# Altium schematic sheet buffer.SchDoc
size A4; SheetNumber: 8; SheetTotal: 12
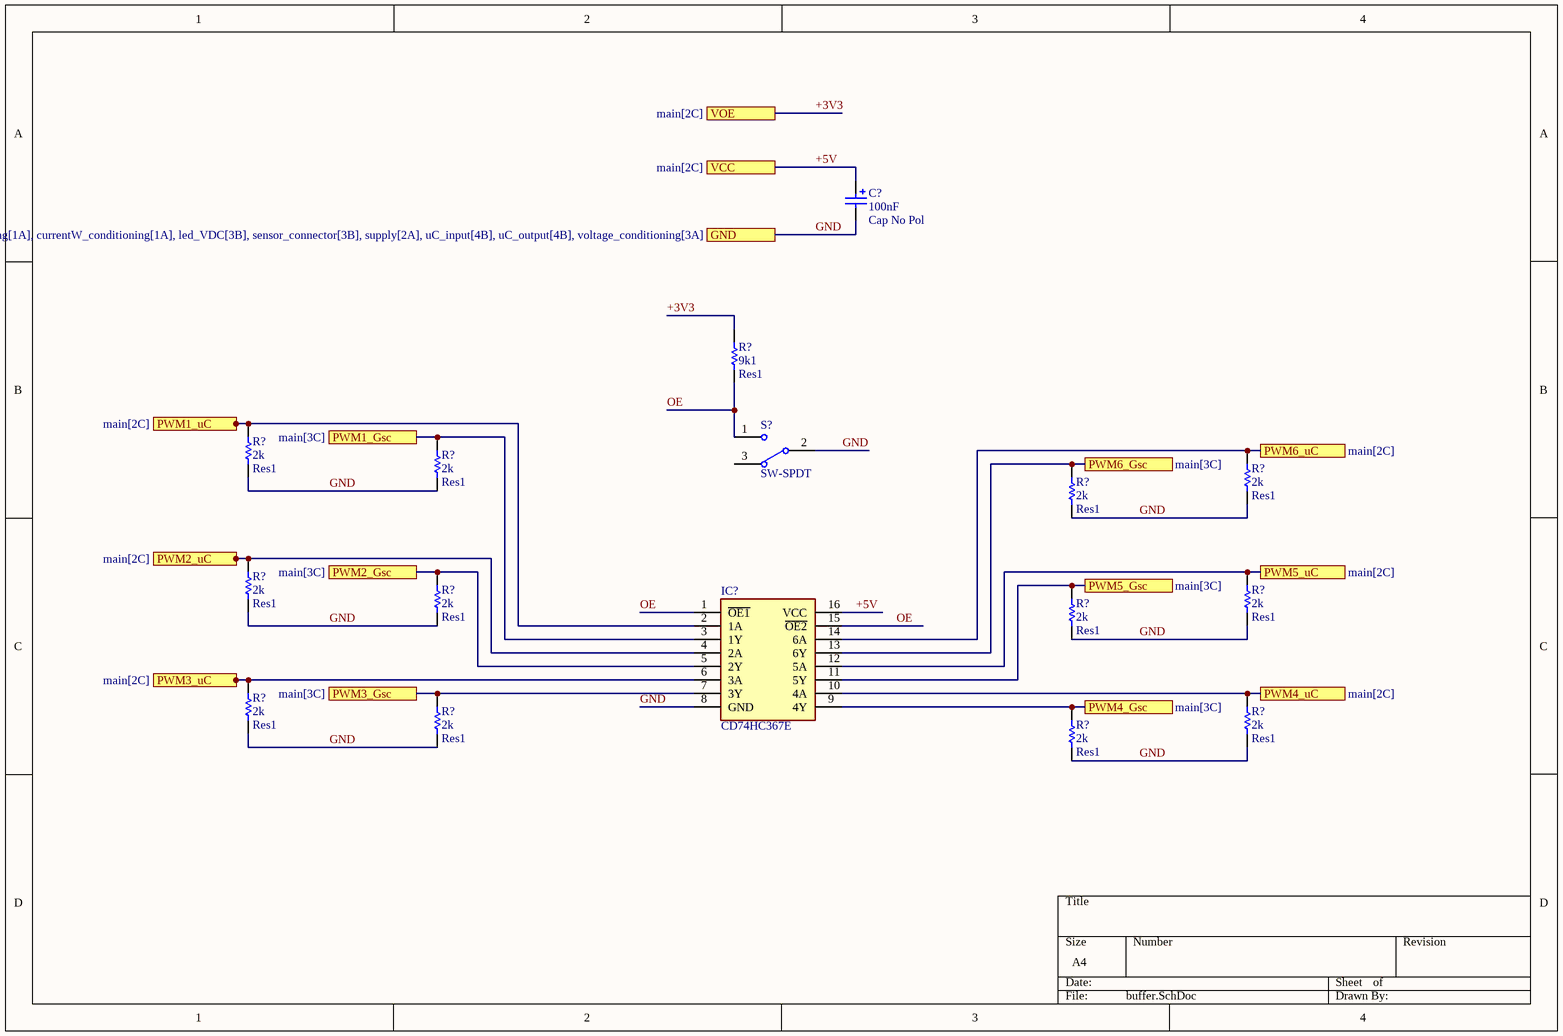
[diagram p0: buffer.SchDoc]

## Parts
(Parts that share a designator on the sheet are numbered #1, #2 ... from top to bottom, then left to right.)
C?  Cap No Pol  value 100nF  [RAD-0.1]
IC?  CD74HC367E  [DIP794W53P254L1930H508Q16N]
R?#1  Res1  value 9k1  [AXIAL-0.3]
R?#2  Res1  value 2k  [AXIAL-0.3]
R?#3  Res1  value 2k  [AXIAL-0.3]
R?#4  Res1  value 2k  [AXIAL-0.3]
R?#5  Res1  value 2k  [AXIAL-0.3]
R?#6  Res1  value 2k  [AXIAL-0.3]
R?#7  Res1  value 2k  [AXIAL-0.3]
R?#8  Res1  value 2k  [AXIAL-0.3]
R?#9  Res1  value 2k  [AXIAL-0.3]
R?#10  Res1  value 2k  [AXIAL-0.3]
R?#11  Res1  value 2k  [AXIAL-0.3]
R?#12  Res1  value 2k  [AXIAL-0.3]
R?#13  Res1  value 2k  [AXIAL-0.3]
S?  SW-SPDT  [MHDR1X3]

## Ports
GND (see main[3C], control_connector[2D], currentU_conditioning[1A], currentV_conditioning[1A], currentW_conditioning[1A], led_VDC[3B], sensor_connector[3B], supply[2A], uC_input[4B], uC_output[4B], voltage_conditioning[3A]), PWM1_Gsc (see main[3C]), PWM1_uC (see main[2C]), PWM2_Gsc (see main[3C]), PWM2_uC (see main[2C]), PWM3_Gsc (see main[3C]), PWM3_uC (see main[2C]), PWM4_Gsc (see main[3C]), PWM4_uC (see main[2C]), PWM5_Gsc (see main[3C]), PWM5_uC (see main[2C]), PWM6_Gsc (see main[3C]), PWM6_uC (see main[2C]), VCC (see main[2C]), VOE (see main[2C])

## Nets
+3V3: R?#1.2 ; port VOE
+5V: C?.1 IC?.16(VCC) ; port VCC
GND: C?.2 IC?.8(GND) R?#2.1 R?#3.1 R?#4.1 R?#5.1 R?#6.1 R?#7.1 R?#8.1 R?#9.1 R?#10.1 R?#11.1 R?#12.1 R?#13.1 S?.2 ; port GND
OE: IC?.1(~{OE1}) IC?.15(~{OE2}) R?#1.1 S?.1
PWM1_Gsc: IC?.3(1Y) R?#3.2 ; port PWM1_Gsc
PWM1_uC: IC?.2(1A) R?#2.2 ; port PWM1_uC
PWM2_Gsc: IC?.5(2Y) R?#7.2 ; port PWM2_Gsc
PWM2_uC: IC?.4(2A) R?#6.2 ; port PWM2_uC
PWM3_Gsc: IC?.7(3Y) R?#11.2 ; port PWM3_Gsc
PWM3_uC: IC?.6(3A) R?#10.2 ; port PWM3_uC
PWM4_Gsc: IC?.9(4Y) R?#13.2 ; port PWM4_Gsc
PWM4_uC: IC?.10(4A) R?#12.2 ; port PWM4_uC
PWM5_Gsc: IC?.11(5Y) R?#9.2 ; port PWM5_Gsc
PWM5_uC: IC?.12(5A) R?#8.2 ; port PWM5_uC
PWM6_Gsc: IC?.13(6Y) R?#5.2 ; port PWM6_Gsc
PWM6_uC: IC?.14(6A) R?#4.2 ; port PWM6_uC

Not connected (* = marked no-connect by the designer): S? 3

## Library data of the parts
C? = Cap No Pol: Polarized Capacitor (Radial); Published: 8-Jun-2000; LatestRevisionDate: 17-Jul-2002; LatestRevisionNote: Re-released for DXP Platform.; PackageReference: RB7.6-15; Publisher: Altium Limited; PackageDescription: Polarized Capacitor (Radial); 2 Leads
IC? = CD74HC367E: Integrated Circuit; Manufacturer_Name: Texas Instruments; Datasheet Link: https://www.ti.com/lit/ds/symlink/cd74hc367.pdf?ts=1619589374451&ref_url=https%253A%252F%252Fwww.ti.com%252Fstore%252Fti%252Fen%252Fp%252Fproduct%252F%253Fp%253DCD74HC367E; Height: 5.08mm; Manufacturer_Part_Number: CD74HC367E; Mouser Part Number: 595-CD74HC367E; Mouser Price/Stock: https://www.mouser.co.uk/ProductDetail/Texas-Instruments/CD74HC367E?qs=xFfolx0DHx1dmtXXzN7naA%3D%3D
R?#1-R?#13 = Res1: Resistor; Published: 8-Jun-2000; LatestRevisionDate: 17-Jul-2002; LatestRevisionNote: Re-released for DXP Platform.; PackageReference: AXIAL-0.3; Publisher: Altium Limited; PackageDescription: Axial Device, Thru-Hole; 2 Leads; 0.3 in Pin Spacing
S? = SW-SPDT: SPDT Subminiature Toggle Switch, Right Angle Mounting, Vertical Actuation; Published: 24-Mar-1999; LatestRevisionDate: 17-Dec-2003; LatestRevisionNote: Schematic revised, PCB Footprint replaced.; DatasheetVersion: 05-Dec-2000; PackageReference: TL36WW15050; Publisher: Altium Limited; PackageDescription: Switch; 4 Leads; ComponentLink1Description: Manufacturer Link; ComponentLink1URL: http://www.apem.com